# Altium project power_project.PrjPCB
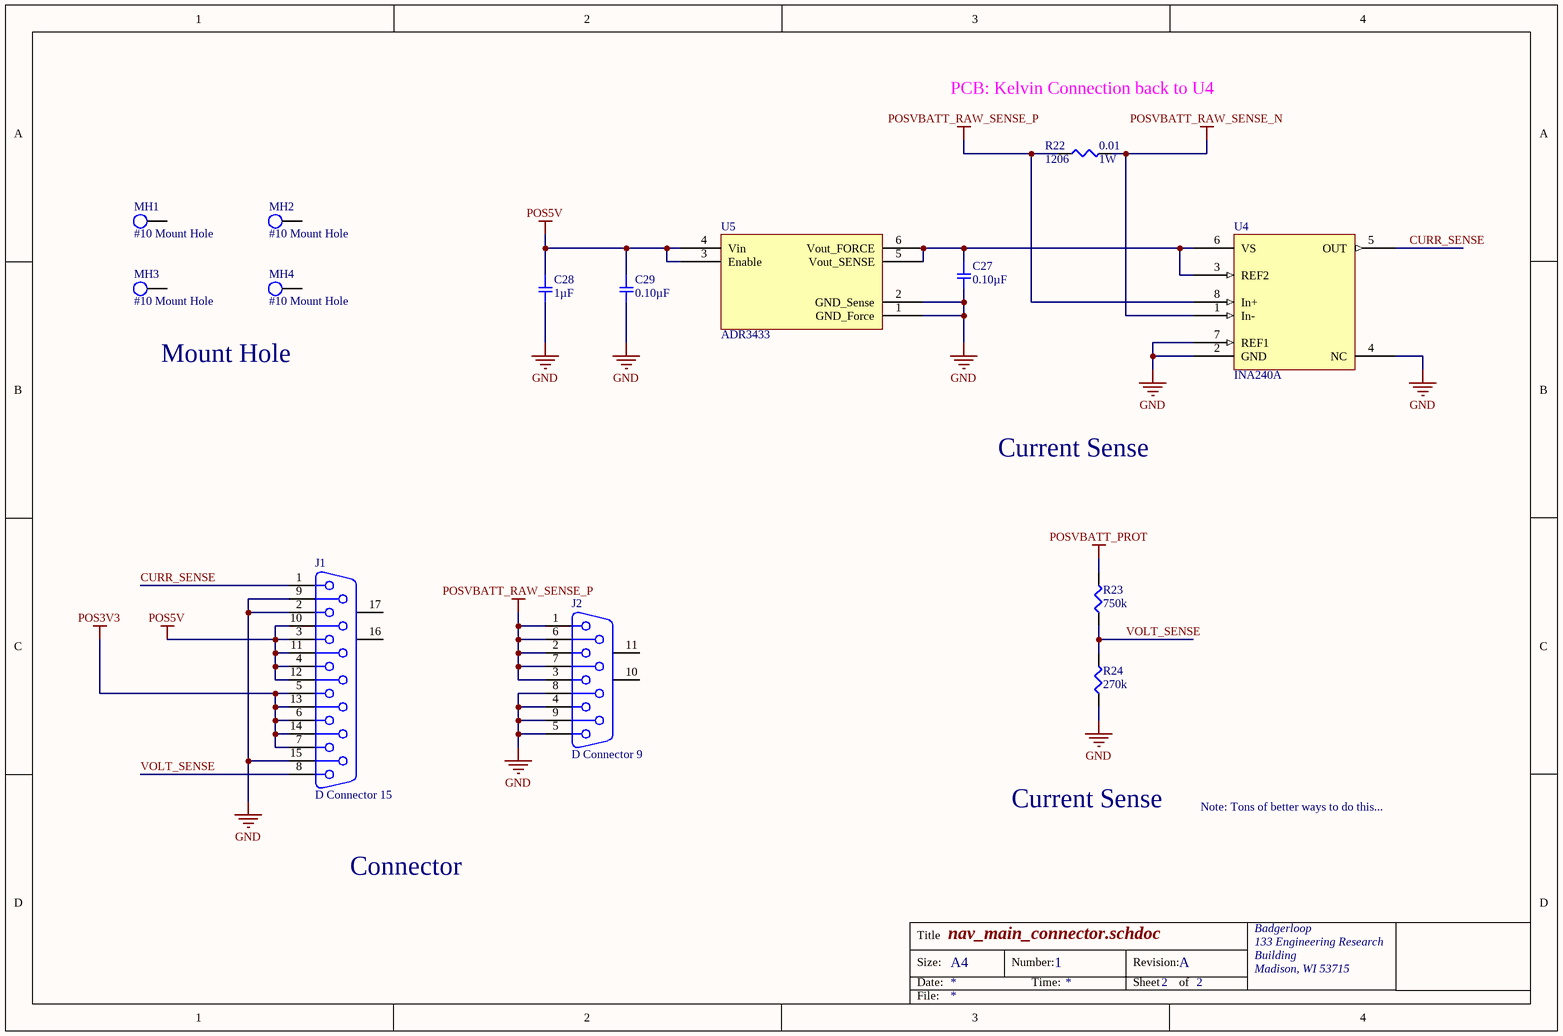
[diagram p0: power_main_connector.SchDoc]
Part_Number: P4_LV_Power; sheetnumber: =SheetNumber; Revision: A; Engineer: R. Castle; Designer: R. Castle
4 sheets, 92 parts. Net scope: global (net labels, ports and power ports of the same name join across sheets).
Board file: power_pcb.PcbDoc
Sheets:
  power_main_connector.SchDoc
  power_PROTECTION.SchDoc
  power_CTL.schdoc
  power_PWR.schdoc

## Sheet power_main_connector.SchDoc: nav_main_connector.schdoc
size A4; Engineer: Ryan Castle; Organization: Badgerloop; Address1: 133 Engineering Research; Address2: Building; Address3: Madison, WI 53715; DocumentNumber: 1; Revision: A; SheetNumber: 2; SheetTotal: 2

### Parts
C27  0.10µF  [SMD-0805C]
C28  1µF  [SMD-0805C]
C29  0.10µF  [SMD-0805C]
J1  D Connector 15  [DSUB1.385-2H15]
J2  D Connector 9  [DSUB1.385-2H9]
MH1  #10 Mount Hole  [MH]
MH2  #10 Mount Hole  [MH]
MH3  #10 Mount Hole  [MH]
MH4  #10 Mount Hole  [MH]
R22  0.01  Power (Watts): 1W  Supplier Device Package: 1206  [SMD-1206-RES]
R23  750k  [SMD-0805-RES]
R24  270k  [SMD-0805-RES]
U4  INA240A  [SOIC127P600X175-8N]
U5  ADR3433  [SOT95P280X145-6N]

### Nets
GND: C27.2 C28.2 C29.2 J1.2 J1.9 J1.15 J2.4 J2.5 J2.8 J2.9 R24.1 U4.2(GND) U4.4(NC) U4.7(REF1) U5.1(GND_Force) U5.2(GND_Sense)
POS3V3: J1.5 J1.6 J1.7 J1.13 J1.14
POS5V: C28.1 C29.1 J1.3 J1.4 J1.10 J1.11 J1.12 U5.3(Enable) U5.4(Vin)
POSVBATT_PROT: R23.2
POSVBATT_RAW_SENSE_N: R22.2 U4.1(In-)
POSVBATT_RAW_SENSE_P: J2.1 J2.2 J2.3 J2.6 J2.7 R22.1 U4.8(In+)
CURR_SENSE: J1.1 U4.5(OUT)
VOLT_SENSE: J1.8 R23.1 R24.2
NetC27_1: C27.1 U4.3(REF2) U4.6(VS) U5.5(Vout_SENSE) U5.6(Vout_FORCE)

Not connected (* = marked no-connect by the designer): J1 16(MH1) 17(MH2); J2 10(MH1) 11(MH2); MH1 46; MH2 46; MH3 46; MH4 46

### Notes on the sheet
- PCB: Kelvin Connection back to U4
- Mount Hole
- Current Sense
- Note: Tons of better ways to do this...
- Connector
- Title
- Size:
- Date:
- A4
- Number:
- Time:
- Revision:
- Sheet
- of
- File:

### Library data of the parts
C27 C29 = GCD21BR71H104KA01L: CAP CER 0.1UF 50V X7R 0805; Manufacturer: Murata Electronics North America; Factory Stock: 0; Unit Price (USD): 0.24; Minimum Quantity: 1; Tolerance: ±10%; Datasheets: http://www.murata.com/~/media/webrenewal/support/library/catalog/products/capacitor/mlcc/c03e.ashx; Image: //media.digikey.com/Renders/Murata%20Renders/0805%28GxM6%29.jpg; Digi-Key Part Number: 490-11955-1-ND; Part Number: GCD21BR71H104KA01L; Quantity Available: 157; @ qty: 0; Packaging: Cut Tape (CT); Series: GCD; Part Status: Active; Value: 0.10µF; Voltage: 50V; Temperature Coefficient: X7R; Operating Temperature: -55°C ~ 125°C; Features: -; Ratings: AEC-Q200; Applications: Automotive; Mounting Type: Surface Mount, MLCC; Package / Case: 0805 (2012 Metric); Size / Dimension: 0.079" L x 0.049" W (2.00mm x 1.25mm); Height - Seated (Max): -; Thickness (Max): 0.049" (1.25mm); Lead Spacing: -; Lead Style: -
C28 = GCJ21BR71H105KA01L: CAP CER 1UF 50V X7R 0805; Manufacturer: Murata Electronics North America; Factory Stock: 0; Unit Price (USD): 0.33; Minimum Quantity: 1; Tolerance: ±10%; Datasheets: http://www.murata.com/~/media/webrenewal/support/library/catalog/products/capacitor/mlcc/c03e.ashx; Image: //media.digikey.com/Renders/Murata%20Renders/0805%20(2012%20Metric)%20.85mm.jpg; Digi-Key Part Number: 490-10667-1-ND; Part Number: GCJ21BR71H105KA01L; Quantity Available: 55137; @ qty: 0; Packaging: Cut Tape (CT); Series: GCJ; Part Status: Active; Value: 1µF; Voltage: 50V; Temperature Coefficient: X7R; Operating Temperature: -55°C ~ 125°C; Features: Soft Termination; Ratings: AEC-Q200; Applications: Automotive, Boardflex Sensitive; Mounting Type: Surface Mount, MLCC; Package / Case: 0805 (2012 Metric); Size / Dimension: 0.079" L x 0.049" W (2.00mm x 1.25mm); Height - Seated (Max): -; Thickness (Max): 0.057" (1.45mm); Lead Spacing: -; Lead Style: -
J1 = D Connector 15: Receptacle Assembly, 15 Position, Right Angle; PackageDocument: O; Positions: 15; Published: 15-Jun-2001; LatestRevisionDate: 17-Jul-2002; LatestRevisionNote: Re-released for DXP Platform.; DatasheetDocument: 1-Sep-99; PackageReference: 788757; Publisher: Altium Limited; Orientation: Right Angle; Gender: Receptacle
J2 = D Connector 9: Receptacle Assembly, 9 Position, Right Angle; PackageDocument: O; Positions: 9; Published: 15-Jun-2001; LatestRevisionDate: 17-Jul-2002; LatestRevisionNote: Re-released for DXP Platform.; DatasheetDocument: 1-Sep-1999; PackageReference: 788750; Publisher: Altium Limited; Orientation: Right Angle; Gender: Receptacle
R22 = ERJ-8CWFR010V: RES SMD 0.01 OHM 1% 1W 1206; Manufacturer: Panasonic Electronic Components; Factory Stock: 0; Unit Price (USD): 0.12302; @ qty: 1500; Minimum Quantity: 1; Temperature Coefficient: ±75ppm/°C; Part Number: ERJ-8CWFR010V; Datasheets: https://industrial.panasonic.com/cdbs/www-data/pdf/RDA0000/AOA0000C239.pdf; Image: //media.digikey.com/Renders/Panasonic%20Renders/ERJ-1206%20Pkg.jpg; Digi-Key Part Number: P0.01BVCT-ND; Quantity Available: 2; Packaging: Cut Tape (CT); Series: ERJ; Part Status: Active; Value: 0.01; Tolerance: ±1%; Composition: Thick Film; Features: Automotive AEC-Q200, Current Sense; Operating Temperature: -55°C ~ 155°C; Package / Case: 1206 (3216 Metric); Size / Dimension: 0.126" L x 0.063" W (3.20mm x 1.60mm); Height - Seated (Max): 0.030" (0.75mm); Number of Terminations: 2; Failure Rate: -
R23 = ERJ-6GEYJ754V: RES SMD 750K OHM 5% 1/8W 0805; Manufacturer: Panasonic Electronic Components; Factory Stock: 0; Unit Price (USD): 0.00496; @ qty: 1500; Minimum Quantity: 1; Power (Watts): 0.125W, 1/8W; Temperature Coefficient: ±200ppm/°C; Part Number: ERJ-6GEYJ754V; Datasheets: http://industrial.panasonic.com/www-cgi/jvcr13pz.cgi?E+PZ+3+AOA0001+ERJ6GEYJ754V+7+WW; Image: //media.digikey.com/Renders/Panasonic%20Renders/ERJ-0805%20Pkg.jpg; Digi-Key Part Number: P750KACT-ND; Quantity Available: 45411; Packaging: Cut Tape (CT); Series: ERJ; Part Status: Active; Value: 750k; Tolerance: ±5%; Composition: Thick Film; Features: Automotive AEC-Q200; Operating Temperature: -55°C ~ 155°C; Package / Case: 0805 (2012 Metric); Supplier Device Package: 0805; Size / Dimension: 0.079" L x 0.049" W (2.00mm x 1.25mm); Height - Seated (Max): 0.028" (0.70mm); Number of Terminations: 2; Failure Rate: -
R24 = ERJ-6GEYJ274V: RES SMD 270K OHM 5% 1/8W 0805; Manufacturer: Panasonic Electronic Components; Factory Stock: 0; Unit Price (USD): 0.00496; @ qty: 1500; Minimum Quantity: 1; Power (Watts): 0.125W, 1/8W; Temperature Coefficient: ±200ppm/°C; Part Number: ERJ-6GEYJ274V; Datasheets: http://industrial.panasonic.com/www-cgi/jvcr13pz.cgi?E+PZ+3+AOA0001+ERJ6GEYJ274V+7+WW; Image: //media.digikey.com/Renders/Panasonic%20Renders/ERJ-0805%20Pkg.jpg; Digi-Key Part Number: P270KACT-ND; Quantity Available: 55427; Packaging: Cut Tape (CT); Series: ERJ; Part Status: Active; Value: 270k; Tolerance: ±5%; Composition: Thick Film; Features: Automotive AEC-Q200; Operating Temperature: -55°C ~ 155°C; Package / Case: 0805 (2012 Metric); Supplier Device Package: 0805; Size / Dimension: 0.079" L x 0.049" W (2.00mm x 1.25mm); Height - Seated (Max): 0.028" (0.70mm); Number of Terminations: 2; Failure Rate: -
U4 = INA240A: IC AMP CURRENT SENSE 8-TSSOP; Manufacturer: TI; Manufacturer P/N: INA240A1PWR; Digikey P/N: 296-45088-1-ND; Digikey Link: https://www.digikey.com/product-detail/en/texas-instruments/INA240A1PWR/296-45088-1-ND/6562101
U5 = ADR3433: IC VREF SERIES 3.3V SOT23-6; Manufacturer: Analog Devices; Manufacturer P/N: ADR3433ARJZ-R7; ComponentLink1Description: Digikey; ComponentLink1URL: https://www.digikey.com/product-detail/en/analog-devices-inc/ADR3433ARJZ-R7/ADR3433ARJZ-R7CT-ND/4909083; Digikey Link: https://www.digikey.com/product-detail/en/analog-devices-inc/ADR3433ARJZ-R7/ADR3433ARJZ-R7CT-ND/4909083; Digikey P/N: ADR3433ARJZ-R7CT-ND

## Sheet power_PROTECTION.SchDoc: power_PROTECTION.SchDoc
size A4; Organization: Badgerloop; Address1: 133 Engineering Research; Address2: Building; Address3: Madison, WI 53715
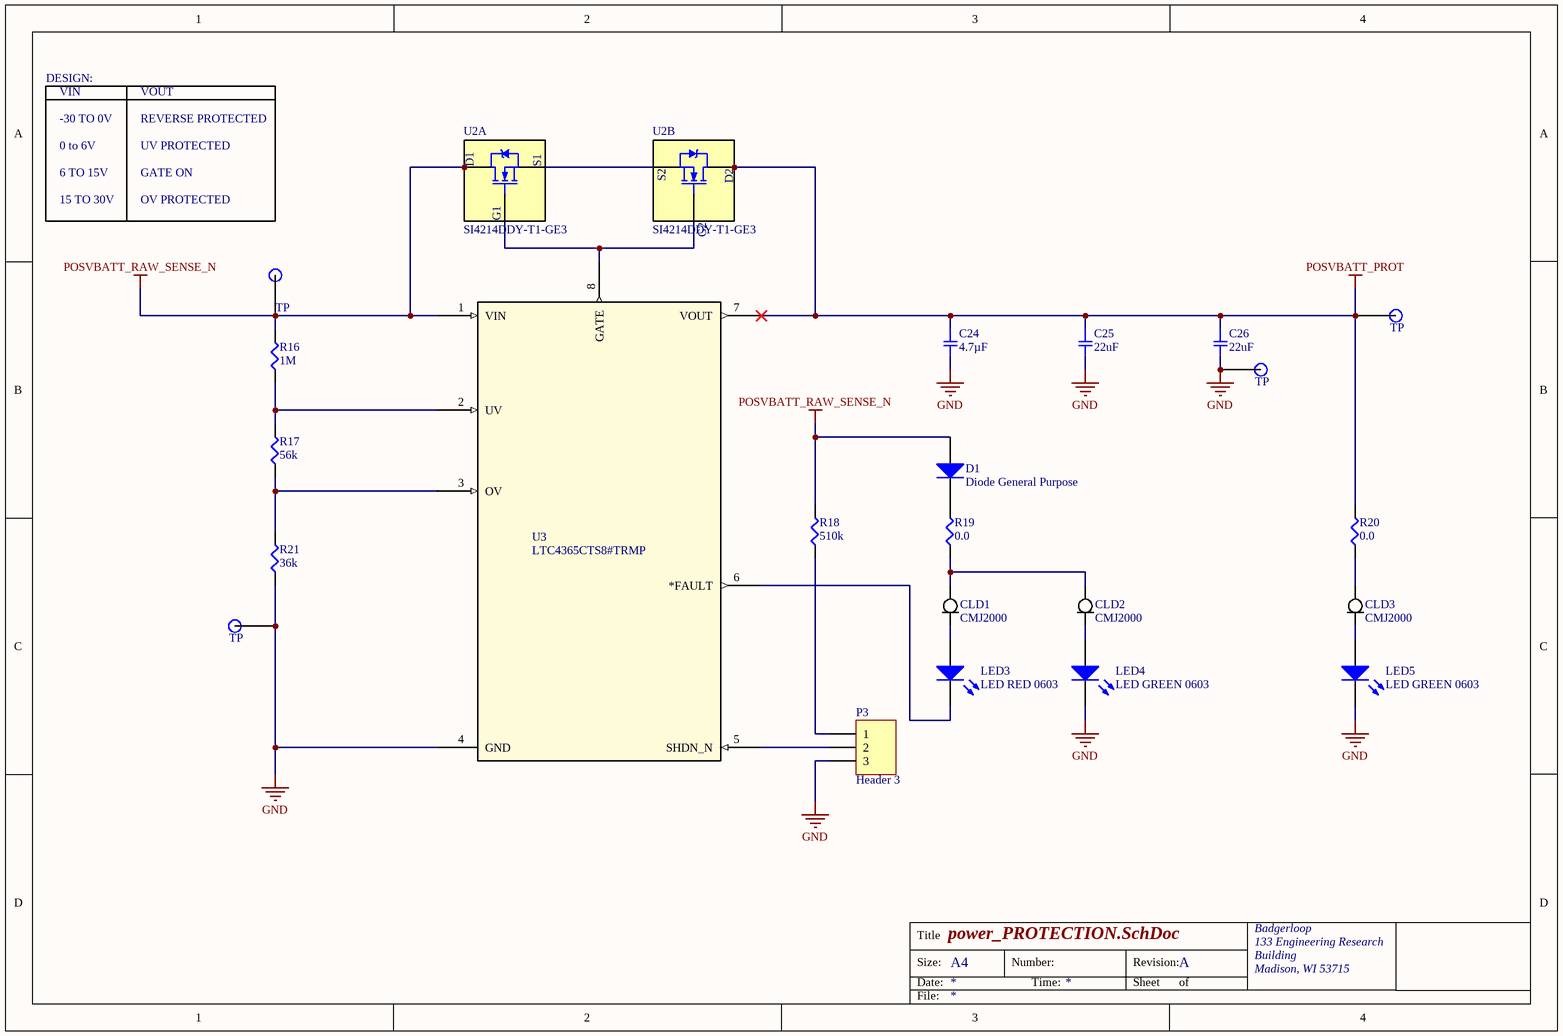
[diagram p1: power_PROTECTION.SchDoc]

### Parts
C24  4.7µF  [SMD-0805C]
C25  22uF  [SMD-0805C]
C26  22uF  [SMD-0805C]
CLD1  CMJ2000  [SODFL350X80-2N]
CLD2  CMJ2000  [SODFL350X80-2N]
CLD3  CMJ2000  [SODFL350X80-2N]
D1  Diode General Purpose  [Diode General Purpose]
LED3  LED RED 0603  [LED 0603 RED]
LED4  LED GREEN 0603  [LED 0603 GREEN]
LED5  LED GREEN 0603  [LED 0603 GREEN]
P3  Header 3  [Pin Header 1x3 TH Pitch 2.54mm]
R16  1M  [SMD-0402-RES]
R17  56k  [SMD-0402-RES]
R18  510k  [SMD-0402-RES]
R19  0.0  [SMD-0402-RES]
R20  0.0  [SMD-0402-RES]
R21  36k  [SMD-0402-RES]
TP9  TP  [Test Point]
TP10  TP  [Test Point]
TP11  TP  [Test Point]
TP13  TP  [Test Point]
U2  SI4214DDY-T1-GE3  [SOIC-8_SI-L]  (parts A,B of 2)
U3  LTC4365CTS8#TRMP  [TSOT-23_TS8]

### Nets
GND: C24.2 C25.2 C26.2 LED4.2(K) LED5.2(K) P3.3 R21.1 TP10.1 TP13.1 U3.4(GND)
POSVBATT_PROT: C24.1 C25.1 C26.1 R20.2 TP11.1 U2.5(D2) U2.6(D2) U3.7(VOUT)
POSVBATT_RAW_SENSE_N: D1.1(A) R16.2 R18.2 TP9.1 U2.7(D1) U2.8(D1) U3.1(VIN)
NetCLD1_1: CLD1.1 CLD2.1 R19.1
NetCLD1_2: CLD1.2 LED3.1(A)
NetCLD2_2: CLD2.2 LED4.1(A)
NetCLD3_1: CLD3.1 R20.1
NetCLD3_2: CLD3.2 LED5.1(A)
NetD1_2: D1.2(K) R19.2
NetLED3_2: LED3.2(K) U3.6(*FAULT)
NetP3_1: P3.1 R18.1
NetP3_2: P3.2 U3.5(SHDN_N)
NetR16_1: R16.1 R17.2 U3.2(UV)
NetR17_1: R17.1 R21.2 U3.3(OV)
NetU2_1: U2.1(S1) U2.3(S2)
NetU2_2: U2.2(G1) U2.4(G2) U3.8(GATE)

### Notes on the sheet
- DESIGN:
- VIN
- VOUT
- -30 TO 0V
- 0 to 6V
- 6 TO 15V
- REVERSE PROTECTED
- UV PROTECTED
- GATE ON
- 15 TO 30V
- OV PROTECTED
- Title
- Size:
- Date:
- A4
- Number:
- Time:
- Revision:
- Sheet
- of
- File:

### Library data of the parts
C24 = GRM21BR61H475KE51L: CAP CER 4.7UF 50V X5R 0805; Manufacturer: Murata Electronics North America; Factory Stock: 0; Unit Price (USD): 0.37; Minimum Quantity: 1; Tolerance: ±10%; Datasheets: http://www.murata.com/~/media/webrenewal/support/library/catalog/products/capacitor/mlcc/c02e.pdf; Image: //media.digikey.com/Renders/Murata%20Renders/0805%20(2012%20Metric)%20.85mm.jpg; Digi-Key Part Number: 490-10751-1-ND; Part Number: GRM21BR61H475KE51L; Quantity Available: 29522; @ qty: 0; Packaging: Cut Tape (CT); Series: GRM; Part Status: Active; Value: 4.7µF; Voltage: 50V; Temperature Coefficient: X5R; Operating Temperature: -55°C ~ 85°C; Features: -; Ratings: -; Applications: General Purpose; Mounting Type: Surface Mount, MLCC; Package / Case: 0805 (2012 Metric); Size / Dimension: 0.079" L x 0.049" W (2.00mm x 1.25mm); Height - Seated (Max): -; Thickness (Max): 0.055" (1.40mm); Lead Spacing: -; Lead Style: -
C25 C26 = GC321AD72E103KX01D: CAP CER 10000PF 250V X7T 0805; Part Number: C2012JB1V226M125AC; Manufacturer: TDK Corporation; Factory Stock: 10000; Unit Price (USD): 0.3; @ qty: 0; Minimum Quantity: 1; Tolerance: ±20%; Voltage: 35V; Temperature Coefficient: JB; Image: //media.digikey.com/Renders/Murata%20Renders/0805(GC3)200x125.jpg; Digi-Key Part Number: 445-11527-1-ND; Quantity Available: 4000; Packaging: Cut Tape (CT); Series: GC3; Part Status: Active; Value: 22uF; Operating Temperature: -55°C ~ 125°C; Features: -; Ratings: AEC-Q200; Applications: Automotive; Mounting Type: Surface Mount, MLCC; Package / Case: 0805; Size / Dimension: 0.079" L x 0.049" W (2.00mm x 1.25mm); Height - Seated (Max): -; Thickness (Max): 0.039" (1.00mm); Lead Spacing: -; Lead Style: -
CLD1-CLD3 = DIODE Current Limiting Single SM: Manufacturer: Central Semiconductor Corp; Manufacturer P/N: CMJ2000 TR; Vin Max: 100V; Current Output: 2mA; Do Not Populate: *; ComponentLink1Description: Digikey; ComponentLink1URL: https://www.digikey.com/product-detail/en/central-semiconductor-corp/CMJ2000-TR/CMJ2000CT-ND/5018676; Package / Case: SOD-123F; Digikey P/N: CMJ2000CT-ND
D1 = Diode General Purpose: DIODE GEN PURP 100V 150MA SOD123; Manufacturer: Micro Commercial Co; Manufacturer P/N: 1N4148W-TP; ComponentLink1Description: Digikey; ComponentLink1URL: https://www.digikey.com/product-detail/en/micro-commercial-co/1N4148W-TP/1N4148WTPMSTR-ND/717196; Digikey P/N: 1N4148WTPMSTR-ND; Package / Case: SOD123; Do Not Populate: *
LED3 = LED RED 0603: Red 631nm LED Indication - Discrete 2V 0603 (1608 Metric); Manufacturer: Lite-On Inc.; Manufacturer P/N: LTST-C190KRKT; Digikey P/N: 160-1436-1-ND; Package / Case: 0603; Color: RED
LED4 LED5 = LED GREEN 0603: Manufacturer: Lite-On Inc.; Manufacturer P/N: LTST-C190KGKT; Digikey P/N: 160-1435-1-ND; Package / Case: 0603; Color: GREEN
P3 = Header 3: Header, 3-Pin; LatestRevisionDate: 17-Jul-2002; LatestRevisionNote: Re-released for DXP Platform.; Publisher: Altium Limited
R16 = ERJ-2GEJ105X: RES SMD 1M OHM 5% 1/10W 0402; Manufacturer: Panasonic Electronic Components; Factory Stock: 0; Unit Price (USD): 0.00350; @ qty: 1500; Minimum Quantity: 1; Power (Watts): 0.1W, 1/10W; Temperature Coefficient: ±200ppm/°C; Part Number: ERJ-2GEJ105X; Datasheets: http://industrial.panasonic.com/www-cgi/jvcr13pz.cgi?E+PZ+3+AOA0001+ERJ2GEJ105X+7+WW; Image: //media.digikey.com/Photos/Panasonic%20Photos/ERJ-PA2-Series.jpg; Digi-Key Part Number: P1.0MJCT-ND; Quantity Available: 1082572; Packaging: Cut Tape (CT); Series: ERJ; Part Status: Active; Value: 1M; Tolerance: ±5%; Composition: Thick Film; Features: Automotive AEC-Q200; Operating Temperature: -55°C ~ 155°C; Package / Case: 0402 (1005 Metric); Supplier Device Package: 0402; Size / Dimension: 0.039" L x 0.020" W (1.00mm x 0.50mm); Height - Seated (Max): 0.016" (0.40mm); Number of Terminations: 2; Failure Rate: -
R17 = ERJ-2GEJ563X: RES SMD 56K OHM 5% 1/10W 0402; Manufacturer: Panasonic Electronic Components; Factory Stock: 0; Unit Price (USD): 0.00350; @ qty: 1500; Minimum Quantity: 1; Power (Watts): 0.1W, 1/10W; Temperature Coefficient: ±200ppm/°C; Part Number: ERJ-2GEJ563X; Datasheets: http://industrial.panasonic.com/www-cgi/jvcr13pz.cgi?E+PZ+3+AOA0001+ERJ2GEJ563X+7+WW; Image: //media.digikey.com/Photos/Panasonic%20Photos/ERJ-PA2-Series.jpg; Digi-Key Part Number: P56KJCT-ND; Quantity Available: 208344; Packaging: Cut Tape (CT); Series: ERJ; Part Status: Active; Value: 56k; Tolerance: ±5%; Composition: Thick Film; Features: Automotive AEC-Q200; Operating Temperature: -55°C ~ 155°C; Package / Case: 0402 (1005 Metric); Supplier Device Package: 0402; Size / Dimension: 0.039" L x 0.020" W (1.00mm x 0.50mm); Height - Seated (Max): 0.016" (0.40mm); Number of Terminations: 2; Failure Rate: -
R18 = ERJ-2GEJ514X: RES SMD 510K OHM 5% 1/10W 0402; Manufacturer: Panasonic Electronic Components; Factory Stock: 0; Unit Price (USD): 0.00350; @ qty: 1500; Minimum Quantity: 1; Power (Watts): 0.1W, 1/10W; Temperature Coefficient: ±200ppm/°C; Part Number: ERJ-2GEJ514X; Datasheets: http://industrial.panasonic.com/www-cgi/jvcr13pz.cgi?E+PZ+3+AOA0001+ERJ2GEJ514X+7+WW; Image: //media.digikey.com/Photos/Panasonic%20Photos/ERJ-PA2-Series.jpg; Digi-Key Part Number: P510KJCT-ND; Quantity Available: 151230; Packaging: Cut Tape (CT); Series: ERJ; Part Status: Active; Value: 510k; Tolerance: ±5%; Composition: Thick Film; Features: Automotive AEC-Q200; Operating Temperature: -55°C ~ 155°C; Package / Case: 0402 (1005 Metric); Supplier Device Package: 0402; Size / Dimension: 0.039" L x 0.020" W (1.00mm x 0.50mm); Height - Seated (Max): 0.016" (0.40mm); Number of Terminations: 2; Failure Rate: -
R19 R20 = ERJ-2GE0R00X: RES SMD 0.0OHM JUMPER 1/10W 0402; Manufacturer: Panasonic Electronic Components; Factory Stock: 0; Unit Price (USD): 0.00384; @ qty: 1500; Minimum Quantity: 1; Power (Watts): 0.1W, 1/10W; Part Number: ERJ-2GE0R00X; Datasheets: http://industrial.panasonic.com/www-cgi/jvcr13pz.cgi?E+PZ+3+AOA0001+ERJ2GE0R00X+7+WW; Image: //media.digikey.com/Photos/Panasonic%20Photos/ERJ-PA2-Series.jpg; Digi-Key Part Number: P0.0JCT-ND; Quantity Available: 3152483; Packaging: Cut Tape (CT); Series: ERJ; Part Status: Active; Value: 0.0; Tolerance: Jumper; Composition: Thick Film; Features: Automotive AEC-Q200; Temperature Coefficient: -; Operating Temperature: -55°C ~ 155°C; Package / Case: 0402 (1005 Metric); Supplier Device Package: 0402; Size / Dimension: 0.039" L x 0.020" W (1.00mm x 0.50mm); Height - Seated (Max): 0.016" (0.40mm); Number of Terminations: 2; Failure Rate: -
R21 = ERJ-2RKF3602X: RES SMD 36K OHM 1% 1/10W 0402; Manufacturer: Panasonic Electronic Components; Factory Stock: 0; Unit Price (USD): 0.00496; @ qty: 1500; Minimum Quantity: 1; Power (Watts): 0.1W, 1/10W; Temperature Coefficient: ±100ppm/°C; Part Number: ERJ-2RKF3602X; Datasheets: http://industrial.panasonic.com/www-cgi/jvcr13pz.cgi?E+PZ+3+AOA0002+ERJ2RKF3602X+7+WW; Image: //media.digikey.com/Photos/Panasonic%20Photos/ERJ-PA2-Series.jpg; Digi-Key Part Number: P36.0KLCT-ND; Quantity Available: 208341; Packaging: Cut Tape (CT); Series: ERJ; Part Status: Active; Value: 36k; Tolerance: ±1%; Composition: Thick Film; Features: Automotive AEC-Q200; Operating Temperature: -55°C ~ 155°C; Package / Case: 0402 (1005 Metric); Supplier Device Package: 0402; Size / Dimension: 0.039" L x 0.020" W (1.00mm x 0.50mm); Height - Seated (Max): 0.016" (0.40mm); Number of Terminations: 2; Failure Rate: -
U2 = SI4214DDY-T1-GE3: Mosfet Array 2 N-Channel (Dual) 30V 8.5A 3.1W Surface Mount 8-SO; Vendor: Vishay; Rds(on): 0.0195; I_D (A): 8.5; Manufacturer_Part_Number: SI4214DDY-T1-GE3; RefDes: U; Type: DEV; Value: Value; Digikey P/N: SI4214DDY-T1-GE3CT-ND; ComponentLink1Description: Digikey; ComponentLink1URL: https://www.digikey.com/product-detail/en/vishay-siliconix/SI4214DDY-T1-GE3/SI4214DDY-T1-GE3CT-ND/3305376; V_DS: 30V; ComponentLink2Description: Datasheet; ComponentLink2URL: http://www.vishay.com/docs/67907/si4214ddy-t1-e3.pdf
U3 = LTC4365CTS8#TRMP: Overvoltage, / Undervoltage and Reverse / Supply Protection Controller; Manufacturer_Part_Number: LTC4365CTS8#TRMPBF; Vendor: Linear Technology; RefDes: RefDes; Type: DEV; Value: Value; Supplier 1: Digi-Key; Supplier Part Number 1: LTC4365CTS8#TRMPBFDKR-ND

## Sheet power_CTL.schdoc: power_CTL.schdoc
size A4; DrawnBy: Ryan Castle; Engineer: Ryan Castle; Organization: Badgerloop; Address1: 133 Engineering Research; Address2: Building; Address3: Madison, WI 53715; DocumentNumber: 1; Revision: A; SheetNumber: 1; SheetTotal: 2
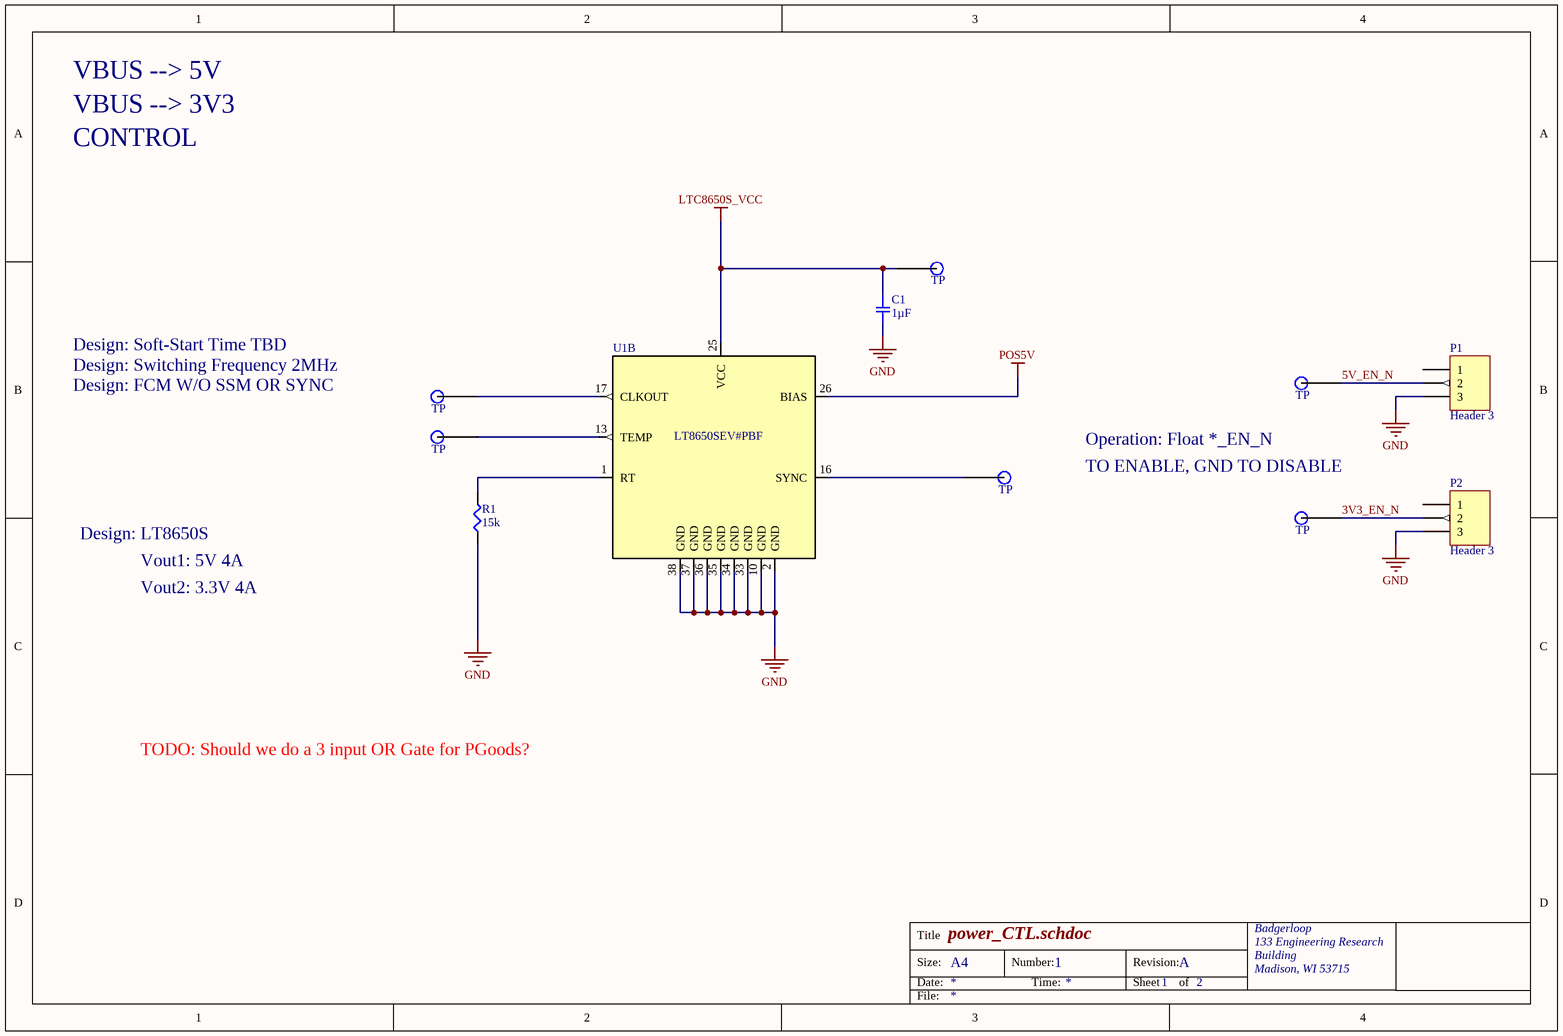
[diagram p2: power_CTL.schdoc]

### Parts
C1  1µF  [SMD-0603C]
P1  Header 3  [Pin Header 1x3 TH Pitch 2.54mm]
P2  Header 3  [Pin Header 1x3 TH Pitch 2.54mm]
R1  15k  [SMD-0402-RES]
TP1  TP  [Test Point]
TP2  TP  [Test Point]
TP3  TP  [Test Point]
TP4  TP  [Test Point]
TP5  TP  [Test Point]
TP6  TP  [Test Point]
U1  LT8650SEV#PBF  [QFN50P600X400X103-32N240X440]  (part B of 2)

### Nets
GND: C1.2 P1.3 P2.3 R1.1 U1.2(GND) U1.10(GND) U1.33(GND) U1.34(GND) U1.35(GND) U1.36(GND) U1.37(GND) U1.38(GND)
LTC8650S_VCC: C1.1 TP1.1 U1.25(VCC)
POS5V: U1.26(BIAS)
3V3_EN_N: P2.2 TP6.1
5V_EN_N: P1.2 TP2.1
NetR1_2: R1.2 U1.1(RT)
NetTP3_1: TP3.1 U1.17(CLKOUT)
NetTP4_1: TP4.1 U1.13(TEMP)
NetTP5_1: TP5.1 U1.16(SYNC)

Not connected (* = marked no-connect by the designer): P1 1; P2 1

### Notes on the sheet
- VBUS --> 5V
- VBUS --> 3V3
- CONTROL
- Design: Soft-Start Time TBD
- Design: Switching Frequency 2MHz
- Design: FCM W/O SSM OR SYNC
- Operation: Float *_EN_N
- (near TP6) TO ENABLE, GND TO DISABLE
- Design: LT8650S
- Vout1: 5V 4A
- Vout2: 3.3V 4A
- TODO: Should we do a 3 input OR Gate for PGoods?
- Title
- Size:
- Date:
- A4
- Number:
- Time:
- Revision:
- Sheet
- of
- File:

### Library data of the parts
C1 = GRM188R61H105KAALD: CAP CER 1UF 50V X5R 0603; Manufacturer: Murata Electronics North America; Factory Stock: 0; Unit Price (USD): 0.17; Minimum Quantity: 1; Tolerance: ±10%; Datasheets: http://www.murata.com/~/media/webrenewal/support/library/catalog/products/capacitor/mlcc/c02e.pdf; Image: //media.digikey.com/Renders/Murata%20Renders/ZRB-SERIES-0402.jpg; Digi-Key Part Number: 490-10732-1-ND; Part Number: GRM188R61H105KAALD; Quantity Available: 46576; @ qty: 0; Packaging: Cut Tape (CT); Series: GRM; Part Status: Active; Value: 1µF; Voltage: 50V; Temperature Coefficient: X5R; Operating Temperature: -55°C ~ 85°C; Features: -; Ratings: -; Applications: General Purpose; Mounting Type: Surface Mount, MLCC; Package / Case: 0603 (1608 Metric); Size / Dimension: 0.063" L x 0.031" W (1.60mm x 0.80mm); Height - Seated (Max): -; Thickness (Max): 0.035" (0.90mm); Lead Spacing: -; Lead Style: -
P1 P2 = Header 3: Header, 3-Pin; LatestRevisionDate: 17-Jul-2002; LatestRevisionNote: Re-released for DXP Platform.; Publisher: Altium Limited
R1 = ERJ-2GEJ153X: RES SMD 15K OHM 5% 1/10W 0402; Manufacturer: Panasonic Electronic Components; Factory Stock: 0; Unit Price (USD): 0.00350; @ qty: 1500; Minimum Quantity: 1; Power (Watts): 0.1W, 1/10W; Temperature Coefficient: ±200ppm/°C; Part Number: ERJ-2GEJ153X; Datasheets: http://industrial.panasonic.com/www-cgi/jvcr13pz.cgi?E+PZ+3+AOA0001+ERJ2GEJ153X+7+WW; Image: //media.digikey.com/Photos/Panasonic%20Photos/ERJ-PA2-Series.jpg; Digi-Key Part Number: P15KJCT-ND; Quantity Available: 331812; Packaging: Cut Tape (CT); Series: ERJ; Part Status: Active; Value: 15k; Tolerance: ±5%; Composition: Thick Film; Features: Automotive AEC-Q200; Operating Temperature: -55°C ~ 155°C; Package / Case: 0402 (1005 Metric); Supplier Device Package: 0402; Size / Dimension: 0.039" L x 0.020" W (1.00mm x 0.50mm); Height - Seated (Max): 0.016" (0.40mm); Number of Terminations: 2; Failure Rate: -
U1 = LT8650SEV#PBF: LT8650S - Dual Channel 4A, 42V, Synchronous Step-Down Silent Switcher 2 with 6.2ÂµA Quiescent Current; MF: Linear Technology; MP: LT8650SEV#PBF; SnapEDA_Link: https://www.snapeda.com/parts/LT8650SEV%23PBF/Linear%20Technology/Analog%20Devices/view-part/?ref=snap; Digi-Key_Part_Number: LT8650SEV#PBF-ND; Package: LQFN-32 Linear Technology; Digi-Key_Purchase_URL: https://www.digikey.com/product-detail/en/linear-technology-analog-devices/LT8650SEV-PBF/LT8650SEV-PBF-ND/7702365?utm_source=snapeda&utm_medium=aggregator&utm_campaign=symbol; Value: *

## Sheet power_PWR.schdoc: power_PWR.SchDoc
size A4; Organization: Badgerloop; Address1: 133 Engineering Research; Address2: Building; Address3: Madison, WI 53715; DocumentNumber: 1; Revision: A; SheetNumber: 1; SheetTotal: 2
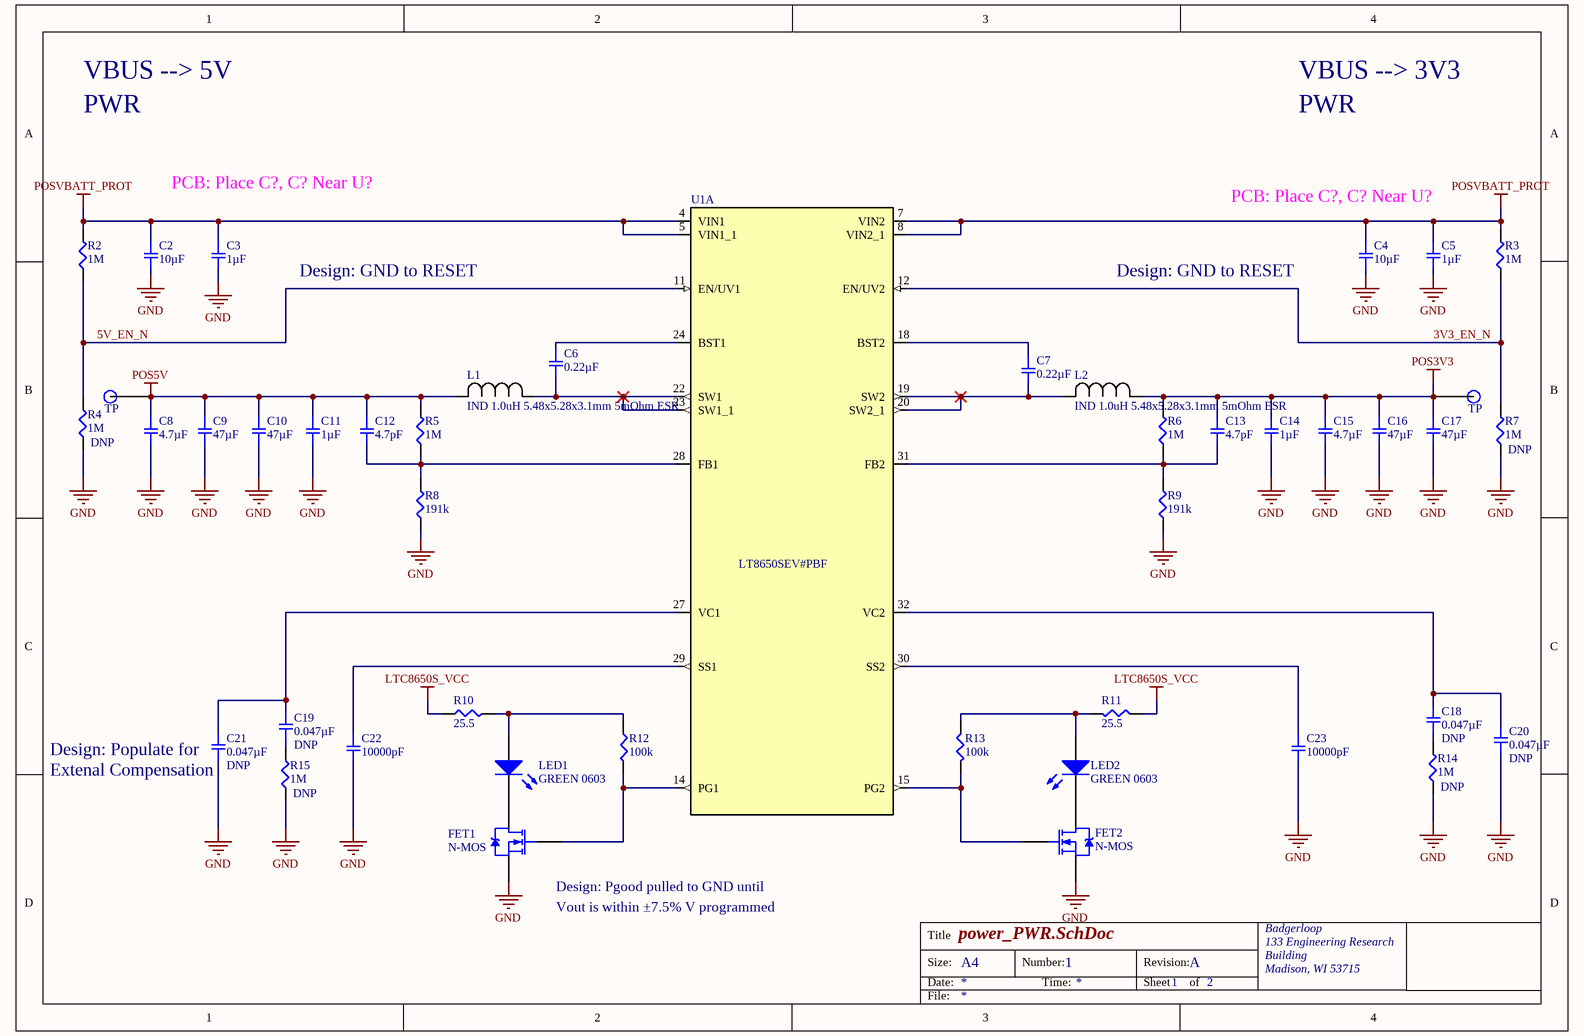
[diagram p3: power_PWR.schdoc]

### Parts
C2  10µF  [SMD-1206C]
C3  1µF  [SMD-0805C]
C4  10µF  [SMD-1206C]
C5  1µF  [SMD-0805C]
C6  0.22µF  [SMD-0603C]
C7  0.22µF  [SMD-0603C]
C8  4.7µF  [SMD-0603C]
C9  47µF  [SMD-1206C]
C10  47µF  [SMD-1206C]
C11  1µF  [SMD-0603C]
C12  4.7pF  [SMD-0603C]
C13  4.7pF  [SMD-0603C]
C14  1µF  [SMD-0603C]
C15  4.7µF  [SMD-0603C]
C16  47µF  [SMD-1206C]
C17  47µF  [SMD-1206C]
C18  0.047µF  Do Not Populate: DNP  [SMD-0402C]
C19  0.047µF  Do Not Populate: DNP  [SMD-0402C]
C20  0.047µF  Do Not Populate: DNP  [SMD-0402C]
C21  0.047µF  Do Not Populate: DNP  [SMD-0402C]
C22  10000pF  [SMD-0603C]
C23  10000pF  [SMD-0603C]
FET1  N-MOS  [SOT95P240X110-3N]
FET2  N-MOS  [SOT95P240X110-3N]
L1  IND 1.0uH 5.48x5.28x3.1mm 5mOhm ESR  [INDC5649X31N]
L2  IND 1.0uH 5.48x5.28x3.1mm 5mOhm ESR  [INDC5649X31N]
LED1  GREEN 0603  [LED 0603 GREEN]
LED2  GREEN 0603  [LED 0603 GREEN]
R2  1M  [SMD-0402-RES]
R3  1M  [SMD-0402-RES]
R4  1M  Do Not Populate: DNP  [SMD-0402-RES]
R5  1M  [SMD-0402-RES]
R6  1M  [SMD-0402-RES]
R7  1M  Do Not Populate: DNP  [SMD-0402-RES]
R8  191k  [SMD-0402-RES]
R9  191k  [SMD-0402-RES]
R10  25.5  [SMD-0805-RES]
R11  25.5  [SMD-0805-RES]
R12  100k  [SMD-0402-RES]
R13  100k  [SMD-0402-RES]
R14  1M  Do Not Populate: DNP  [SMD-0402-RES]
R15  1M  Do Not Populate: DNP  [SMD-0402-RES]
TP7  TP  [Test Point]
TP8  TP  [Test Point]
U1  LT8650SEV#PBF  [QFN50P600X400X103-32N240X440]  (part A of 2)

### Nets
GND: C2.2 C3.2 C4.2 C5.2 C8.2 C9.2 C10.2 C11.2 C14.2 C15.2 C16.2 C17.2 C20.1 C21.1 C22.2 C23.2 FET1.3(S) FET2.3(S) R4.1 R7.1 R8.1 R9.1 R14.1 R15.1
LTC8650S_VCC: R10.1 R11.1
POS3V3: C13.1 C14.1 C15.1 C16.1 C17.1 L2.1 R6.2 TP8.1
POS5V: C8.1 C9.1 C10.1 C11.1 C12.1 L1.2 R5.2 TP7.1
POSVBATT_PROT: C2.1 C3.1 C4.1 C5.1 R2.2 R3.2 U1.4(VIN1) U1.5(VIN1_1) U1.7(VIN2) U1.8(VIN2_1)
3V3_EN_N: R3.1 R7.2 U1.12(EN/UV2)
5V_EN_N: R2.1 R4.2 U1.11(EN/UV1)
NetC6_1: C6.1 U1.24(BST1)
NetC6_2: C6.2 L1.1 U1.22(SW1) U1.23(SW1_1)
NetC7_1: C7.1 U1.18(BST2)
NetC7_2: C7.2 L2.2 U1.19(SW2) U1.20(SW2_1)
NetC12_2: C12.2 R5.1 R8.2 U1.28(FB1)
NetC13_2: C13.2 R6.1 R9.2 U1.31(FB2)
NetC18_1: C18.1 R14.2
NetC18_2: C18.2 C20.2 U1.32(VC2)
NetC19_1: C19.1 R15.2
NetC19_2: C19.2 C21.2 U1.27(VC1)
NetC22_1: C22.1 U1.29(SS1)
NetC23_1: C23.1 U1.30(SS2)
NetFET1_1: FET1.1(G) R12.2 U1.14(PG1)
NetFET1_2: FET1.2(D) LED1.2(K)
NetFET2_1: FET2.1(G) R13.2 U1.15(PG2)
NetFET2_2: FET2.2(D) LED2.2(K)
NetLED1_1: LED1.1(A) R10.2 R12.1
NetLED2_1: LED2.1(A) R11.2 R13.1

### Notes on the sheet
- VBUS --> 5V
- PWR
- VBUS --> 3V3
- PCB: Place C?, C? Near U?
- Design: GND to RESET
- (near C21) Design: Populate for
- (near C21) Extenal Compensation
- (near FET1) Design: Pgood pulled to GND until
- (near FET1) Vout is within ±7.5% V programmed
- Title
- Size:
- Date:
- A4
- Number:
- Time:
- Revision:
- Sheet
- of
- File:

### Library data of the parts
C2 C4 = GRM31CR61H106KA12L: CAP CER 10UF 50V X5R 1206; Manufacturer: Murata Electronics North America; Factory Stock: 0; Unit Price (USD): 0.65; Minimum Quantity: 1; Tolerance: ±10%; Datasheets: http://www.murata.com/~/media/webrenewal/support/library/catalog/products/capacitor/mlcc/c02e.pdf; Image: //media.digikey.com/Renders/Murata%20Renders/GR331BD72E473KW01L.jpg; Digi-Key Part Number: 490-5961-1-ND; Part Number: GRM31CR61H106KA12L; Quantity Available: 86736; @ qty: 0; Packaging: Cut Tape (CT); Series: GRM; Part Status: Active; Value: 10µF; Voltage: 50V; Temperature Coefficient: X5R; Operating Temperature: -55°C ~ 85°C; Features: -; Ratings: -; Applications: General Purpose; Mounting Type: Surface Mount, MLCC; Package / Case: 1206 (3216 Metric); Size / Dimension: 0.126" L x 0.063" W (3.20mm x 1.60mm); Height - Seated (Max): -; Thickness (Max): 0.071" (1.80mm); Lead Spacing: -; Lead Style: -
C3 C5 = GCJ21BR71H105KA01L: as C28 on sheet power_main_connector; Datasheets: http://www.murata.com/~/media/webrenewal/support/library/catalog/products/capacitor/mlcc/c03e.ashx; Image: //media.digikey.com/Renders/Murata%20Renders/0805%20(2012%20Metric)%20.85mm.jpg; Digi-Key Part Number: 490-10667-1-ND; Part Number: GCJ21BR71H105KA01L; Quantity Available: 55137; @ qty: 0; Packaging: Cut Tape (CT); Series: GCJ; Part Status: Active; Value: 1µF; Voltage: 50V; Temperature Coefficient: X7R; Operating Temperature: -55°C ~ 125°C; Features: Soft Termination; Ratings: AEC-Q200; Applications: Automotive, Boardflex Sensitive; Mounting Type: Surface Mount, MLCC; Package / Case: 0805 (2012 Metric); Size / Dimension: 0.079" L x 0.049" W (2.00mm x 1.25mm); Height - Seated (Max): -; Thickness (Max): 0.057" (1.45mm); Lead Spacing: -; Lead Style: -
C6 C7 = GCJ188R71E224KA12D: CAP CER 0.22UF 25V X7R 0603; Manufacturer: Murata Electronics North America; Factory Stock: 0; Unit Price (USD): 0.24; Minimum Quantity: 1; Tolerance: ±10%; Datasheets: http://www.murata.com/~/media/webrenewal/support/library/catalog/products/capacitor/mlcc/c03e.ashx; Image: //media.digikey.com/Renders/Murata%20Renders/0603%28LQG18%29.jpg; Digi-Key Part Number: 490-5797-1-ND; Part Number: GCJ188R71E224KA12D; Quantity Available: 23903; @ qty: 0; Packaging: Cut Tape (CT); Series: GCJ; Part Status: Active; Value: 0.22µF; Voltage: 25V; Temperature Coefficient: X7R; Operating Temperature: -55°C ~ 125°C; Features: Soft Termination; Ratings: AEC-Q200; Applications: Automotive, Boardflex Sensitive; Mounting Type: Surface Mount, MLCC; Package / Case: 0603 (1608 Metric); Size / Dimension: 0.063" L x 0.031" W (1.60mm x 0.80mm); Height - Seated (Max): -; Thickness (Max): 0.035" (0.90mm); Lead Spacing: -; Lead Style: -
C8 C15 = GRM188R61E475KE11D: CAP CER 4.7UF 25V X5R 0603; Manufacturer: Murata Electronics North America; Factory Stock: 0; Unit Price (USD): 0.32; Minimum Quantity: 1; Tolerance: ±10%; Datasheets: http://www.murata.com/~/media/webrenewal/support/library/catalog/products/capacitor/mlcc/c02e.pdf; Image: //media.digikey.com/Renders/Murata%20Renders/ZRB-SERIES-0402.jpg; Digi-Key Part Number: 490-7203-1-ND; Part Number: GRM188R61E475KE11D; Quantity Available: 150881; @ qty: 0; Packaging: Cut Tape (CT); Series: GRM; Part Status: Active; Value: 4.7µF; Voltage: 25V; Temperature Coefficient: X5R; Operating Temperature: -55°C ~ 85°C; Features: -; Ratings: -; Applications: General Purpose; Mounting Type: Surface Mount, MLCC; Package / Case: 0603 (1608 Metric); Size / Dimension: 0.063" L x 0.031" W (1.60mm x 0.80mm); Height - Seated (Max): -; Thickness (Max): 0.031" (0.80mm); Lead Spacing: -; Lead Style: -
C9 C10 C16 C17 = GRM31CR61A476ME15L: CAP CER 47UF 10V X5R 1206; Manufacturer: Murata Electronics North America; Factory Stock: 0; Unit Price (USD): 0.64; Minimum Quantity: 1; Tolerance: ±20%; Datasheets: http://www.murata.com/~/media/webrenewal/support/library/catalog/products/capacitor/mlcc/c02e.pdf; Image: //media.digikey.com/Renders/Murata%20Renders/GR331BD72E473KW01L.jpg; Digi-Key Part Number: 490-5528-1-ND; Part Number: GRM31CR61A476ME15L; Quantity Available: 151940; @ qty: 0; Packaging: Cut Tape (CT); Series: GRM; Part Status: Active; Value: 47µF; Voltage: 10V; Temperature Coefficient: X5R; Operating Temperature: -55°C ~ 85°C; Features: -; Ratings: -; Applications: General Purpose; Mounting Type: Surface Mount, MLCC; Package / Case: 1206 (3216 Metric); Size / Dimension: 0.126" L x 0.063" W (3.20mm x 1.60mm); Height - Seated (Max): -; Thickness (Max): 0.071" (1.80mm); Lead Spacing: -; Lead Style: -
C11 C14 = GRM188R61H105KAALD: as C1 on sheet power_CTL; Datasheets: http://www.murata.com/~/media/webrenewal/support/library/catalog/products/capacitor/mlcc/c02e.pdf; Image: //media.digikey.com/Renders/Murata%20Renders/ZRB-SERIES-0402.jpg; Digi-Key Part Number: 490-10732-1-ND; Part Number: GRM188R61H105KAALD; Quantity Available: 46576; @ qty: 0; Packaging: Cut Tape (CT); Series: GRM; Part Status: Active; Value: 1µF; Voltage: 50V; Temperature Coefficient: X5R; Operating Temperature: -55°C ~ 85°C; Features: -; Ratings: -; Applications: General Purpose; Mounting Type: Surface Mount, MLCC; Package / Case: 0603 (1608 Metric); Size / Dimension: 0.063" L x 0.031" W (1.60mm x 0.80mm); Height - Seated (Max): -; Thickness (Max): 0.035" (0.90mm); Lead Spacing: -; Lead Style: -
C12 C13 = GRM1885C1H4R7CA01D: CAP CER 4.7PF 50V NP0 0603; Manufacturer: Murata Electronics North America; Factory Stock: 0; Unit Price (USD): 0.1; Minimum Quantity: 1; Tolerance: ±0.25pF; Temperature Coefficient: C0G, NP0; Datasheets: http://www.murata.com/~/media/webrenewal/support/library/catalog/products/capacitor/mlcc/c02e.pdf; Image: //media.digikey.com/Renders/Murata%20Renders/ZRB-SERIES-0402.jpg; Digi-Key Part Number: 490-12722-1-ND; Part Number: GRM1885C1H4R7CA01D; Quantity Available: 25832; @ qty: 0; Packaging: Cut Tape (CT); Series: GRM; Part Status: Active; Value: 4.7pF; Voltage: 50V; Operating Temperature: -55°C ~ 125°C; Features: -; Ratings: -; Applications: General Purpose; Mounting Type: Surface Mount, MLCC; Package / Case: 0603 (1608 Metric); Size / Dimension: 0.063" L x 0.031" W (1.60mm x 0.80mm); Height - Seated (Max): -; Thickness (Max): 0.035" (0.90mm); Lead Spacing: -; Lead Style: -
C18-C21 = GCM155R71C473KA37D: CAP CER 0.047UF 16V X7R 0402; Manufacturer: Murata Electronics North America; Factory Stock: 0; Unit Price (USD): 0.1; Minimum Quantity: 1; Tolerance: ±10%; Datasheets: http://www.murata.com/~/media/webrenewal/support/library/catalog/products/capacitor/mlcc/c03e.ashx; Image: //media.digikey.com/Renders/Murata%20Renders/ZRB-SERIES-0402.jpg; Digi-Key Part Number: 490-6042-1-ND; Part Number: GCM155R71C473KA37D; Quantity Available: 86052; @ qty: 0; Packaging: Cut Tape (CT); Series: GCM; Part Status: Active; Value: 0.047µF; Voltage: 16V; Temperature Coefficient: X7R; Operating Temperature: -55°C ~ 125°C; Features: -; Ratings: AEC-Q200; Applications: Automotive; Mounting Type: Surface Mount, MLCC; Package / Case: 0402 (1005 Metric); Size / Dimension: 0.039" L x 0.020" W (1.00mm x 0.50mm); Height - Seated (Max): -; Thickness (Max): 0.022" (0.55mm); Lead Spacing: -; Lead Style: -
C22 C23 = GRM188R71E103KA01D: CAP CER 10000PF 25V X7R 0603; Manufacturer: Murata Electronics North America; Factory Stock: 0; Unit Price (USD): 0.1; Minimum Quantity: 1; Tolerance: ±10%; Datasheets: http://www.murata.com/~/media/webrenewal/support/library/catalog/products/capacitor/mlcc/c02e.pdf; Image: //media.digikey.com/Renders/Murata%20Renders/ZRB-SERIES-0402.jpg; Digi-Key Part Number: 490-1520-1-ND; Part Number: GRM188R71E103KA01D; Quantity Available: 886950; @ qty: 0; Packaging: Cut Tape (CT); Series: GRM; Part Status: Active; Value: 10000pF; Voltage: 25V; Temperature Coefficient: X7R; Operating Temperature: -55°C ~ 125°C; Features: -; Ratings: -; Applications: General Purpose; Mounting Type: Surface Mount, MLCC; Package / Case: 0603 (1608 Metric); Size / Dimension: 0.063" L x 0.031" W (1.60mm x 0.80mm); Height - Seated (Max): -; Thickness (Max): 0.035" (0.90mm); Lead Spacing: -; Lead Style: -
FET1 FET2 = N-MOS Enhancement Mode: MOSFET N-CH 60V 200MA SOT23-3; Manufacturer: Zetex; Manufacturer P/N: ZVN4106FTA; Digikey P/N: ZVN4106FCT-ND
L1 L2 = IND 1.0uH 5.48x5.28x3.1mm 5mOhm ESR: XFL5030-102ME; Vendor: CoilCraft; Type: DEV; Tolerance: +-20%; Maximum DC Current: 28A; Inductance: 1uH; Qualification: AEC-Q200; Manufacturer_Part_Number: XFL5030-102ME; RefDes: RefDes; Value: 1.0uH; Do Not Populate: *; Temperature: -40C ~ 125C; Package / Case: 5.48mm x 5.28mm x 3.1mm; Height: 3.1mm; Link: https://www.mouser.com/ProductDetail/Coilcraft/XFL5030-102MEB?qs=sGAEpiMZZMsg%252by3WlYCkUy0Se8nYOmwuY%252bO5URw9yeY%3d; Datasheet: https://www.mouser.com/datasheet/2/597/xfl5030-1223909.pdf
LED1 LED2 = LED GREEN 0603: as LED4 on sheet power_PROTECTION; Digikey P/N: 160-1435-1-ND; Package / Case: 0603; Color: GREEN
R2-R7 R14 R15 = ERJ-2RKF1004X: RES SMD 1M OHM 1% 1/10W 0402; Manufacturer: Panasonic Electronic Components; Factory Stock: 0; Unit Price (USD): 0.00496; @ qty: 1500; Minimum Quantity: 1; Power (Watts): 0.1W, 1/10W; Temperature Coefficient: ±100ppm/°C; Part Number: ERJ-2RKF1004X; Datasheets: http://industrial.panasonic.com/www-cgi/jvcr13pz.cgi?E+PZ+3+AOA0002+ERJ2RKF1004X+7+WW; Image: //media.digikey.com/Photos/Panasonic%20Photos/ERJ-PA2-Series.jpg; Digi-Key Part Number: P1.00MLCT-ND; Quantity Available: 773705; Packaging: Cut Tape (CT); Series: ERJ; Part Status: Active; Value: 1M; Tolerance: ±1%; Composition: Thick Film; Features: Automotive AEC-Q200; Operating Temperature: -55°C ~ 155°C; Package / Case: 0402 (1005 Metric); Supplier Device Package: 0402; Size / Dimension: 0.039" L x 0.020" W (1.00mm x 0.50mm); Height - Seated (Max): 0.016" (0.40mm); Number of Terminations: 2; Failure Rate: -
R8 R9 = ERJ-2RKF1913X: RES SMD 191K OHM 1% 1/10W 0402; Manufacturer: Panasonic Electronic Components; Factory Stock: 0; Unit Price (USD): 0.00496; @ qty: 1500; Minimum Quantity: 1; Power (Watts): 0.1W, 1/10W; Temperature Coefficient: ±100ppm/°C; Part Number: ERJ-2RKF1913X; Datasheets: http://industrial.panasonic.com/www-cgi/jvcr13pz.cgi?E+PZ+3+AOA0002+ERJ2RKF1913X+7+WW; Image: //media.digikey.com/Photos/Panasonic%20Photos/ERJ-PA2-Series.jpg; Digi-Key Part Number: P191KLCT-ND; Quantity Available: 44522; Packaging: Cut Tape (CT); Series: ERJ; Part Status: Active; Value: 191k; Tolerance: ±1%; Composition: Thick Film; Features: Automotive AEC-Q200; Operating Temperature: -55°C ~ 155°C; Package / Case: 0402 (1005 Metric); Supplier Device Package: 0402; Size / Dimension: 0.039" L x 0.020" W (1.00mm x 0.50mm); Height - Seated (Max): 0.016" (0.40mm); Number of Terminations: 2; Failure Rate: -
R10 R11 = ERJ-6ENF25R5V: RES SMD 25.5 OHM 1% 1/8W 0805; Manufacturer: Panasonic Electronic Components; Factory Stock: 0; Unit Price (USD): 0.00729; @ qty: 1500; Minimum Quantity: 1; Power (Watts): 0.125W, 1/8W; Temperature Coefficient: ±100ppm/°C; Part Number: ERJ-6ENF25R5V; Datasheets: http://industrial.panasonic.com/www-cgi/jvcr13pz.cgi?E+PZ+3+AOA0002+ERJ6ENF25R5V+7+WW; Image: //media.digikey.com/Renders/Panasonic%20Renders/ERJ-0805%20Pkg.jpg; Digi-Key Part Number: P25.5CCT-ND; Quantity Available: 41783; Packaging: Cut Tape (CT); Series: ERJ; Part Status: Active; Value: 25.5; Tolerance: ±1%; Composition: Thick Film; Features: Automotive AEC-Q200; Operating Temperature: -55°C ~ 155°C; Package / Case: 0805 (2012 Metric); Supplier Device Package: 0805; Size / Dimension: 0.079" L x 0.049" W (2.00mm x 1.25mm); Height - Seated (Max): 0.028" (0.70mm); Number of Terminations: 2; Failure Rate: -
R12 R13 = ERJ-2GEJ104X: RES SMD 100K OHM 5% 1/10W 0402; Manufacturer: Panasonic Electronic Components; Factory Stock: 0; Unit Price (USD): 0.00350; @ qty: 1500; Minimum Quantity: 1; Power (Watts): 0.1W, 1/10W; Temperature Coefficient: ±200ppm/°C; Part Number: ERJ-2GEJ104X; Datasheets: http://industrial.panasonic.com/www-cgi/jvcr13pz.cgi?E+PZ+3+AOA0001+ERJ2GEJ104X+7+WW; Image: //media.digikey.com/Photos/Panasonic%20Photos/ERJ-PA2-Series.jpg; Digi-Key Part Number: P100KJCT-ND; Quantity Available: 2387986; Packaging: Cut Tape (CT); Series: ERJ; Part Status: Active; Value: 100k; Tolerance: ±5%; Composition: Thick Film; Features: Automotive AEC-Q200; Operating Temperature: -55°C ~ 155°C; Package / Case: 0402 (1005 Metric); Supplier Device Package: 0402; Size / Dimension: 0.039" L x 0.020" W (1.00mm x 0.50mm); Height - Seated (Max): 0.016" (0.40mm); Number of Terminations: 2; Failure Rate: -
U1 = LT8650SEV#PBF: as U1 on sheet power_CTL; MP: LT8650SEV#PBF; SnapEDA_Link: https://www.snapeda.com/parts/LT8650SEV%23PBF/Linear%20Technology/Analog%20Devices/view-part/?ref=snap; Digi-Key_Part_Number: LT8650SEV#PBF-ND; Package: LQFN-32 Linear Technology; Digi-Key_Purchase_URL: https://www.digikey.com/product-detail/en/linear-technology-analog-devices/LT8650SEV-PBF/LT8650SEV-PBF-ND/7702365?utm_source=snapeda&utm_medium=aggregator&utm_campaign=symbol; Value: *

## Nets that join several sheets
GND: power_main_connector (16 pins), power_PROTECTION (10 pins), power_CTL (12 pins), power_PWR (24 pins)
LTC8650S_VCC: power_CTL (C1.1 TP1.1 U1.25), power_PWR (R10.1 R11.1)
POS3V3: power_main_connector (5 pins), power_PWR (8 pins)
POS5V: power_main_connector (9 pins), power_CTL (U1.26), power_PWR (8 pins)
POSVBATT_PROT: power_main_connector (R23.2), power_PROTECTION (8 pins), power_PWR (10 pins)
POSVBATT_RAW_SENSE_N: power_main_connector (R22.2 U4.1), power_PROTECTION (7 pins)
3V3_EN_N: power_CTL (P2.2 TP6.1), power_PWR (R3.1 R7.2 U1.12)
5V_EN_N: power_CTL (P1.2 TP2.1), power_PWR (R2.1 R4.2 U1.11)